# EAGLE design GBC USB-C Charging Kit Pro (EAGLE 6.2)
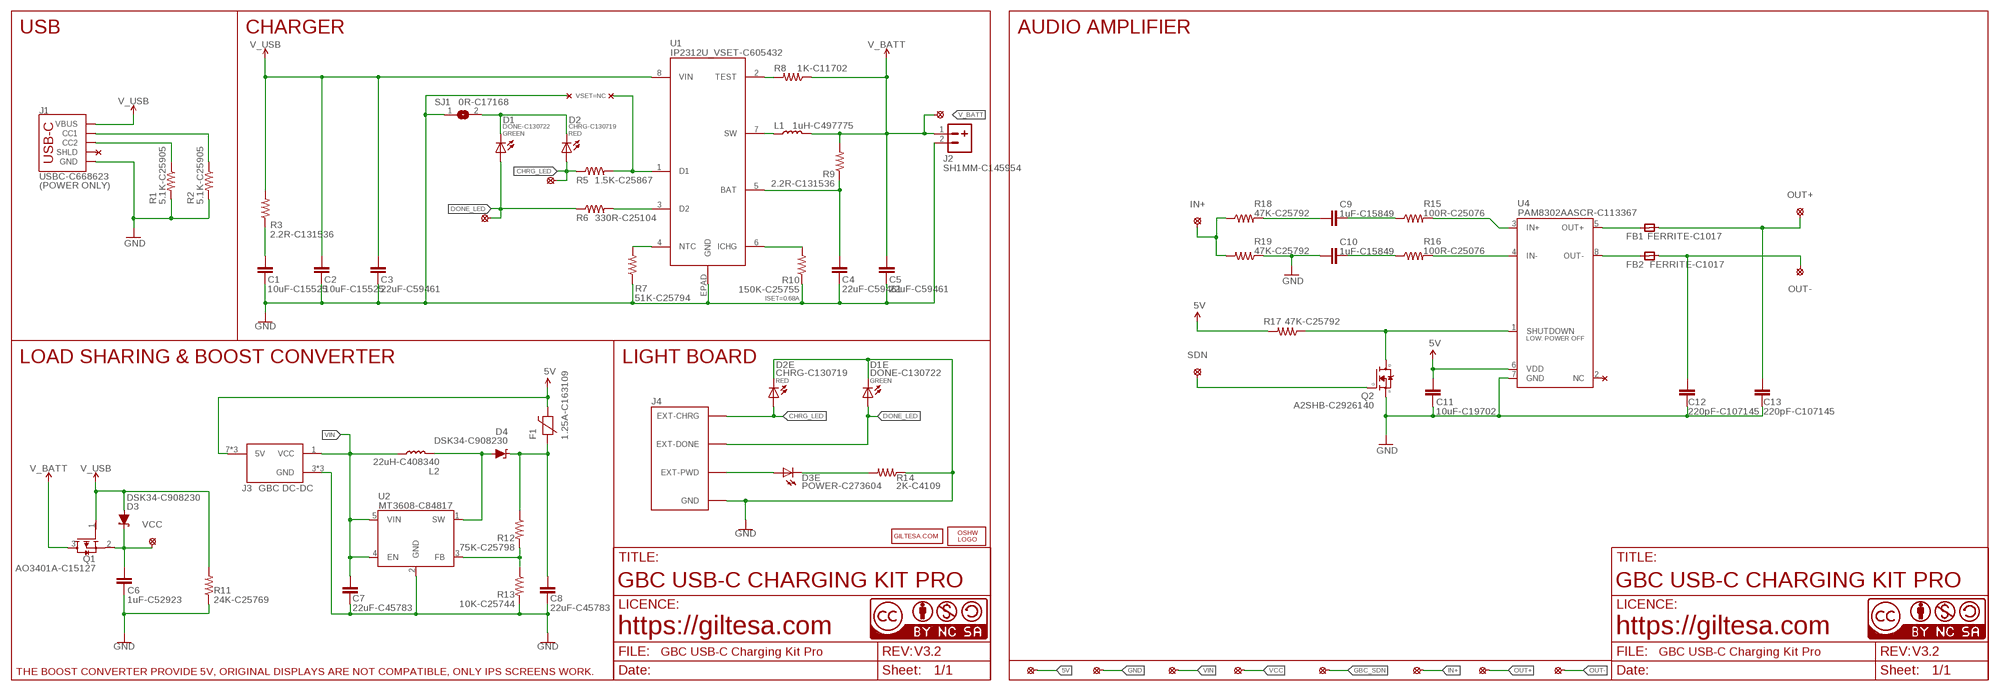
[diagram p0: schematic, sheet 1]

## Parts
C1  10uF-C15525  C0402_S  [C0402_S]
C2  10uF-C15525  C0402_S  [C0402_S]
C3  22uF-C59461  C0603_SMALL  [C0603_S]
C4  22uF-C59461  C0603_SMALL  [C0603_S]
C5  22uF-C59461  C0603_SMALL  [C0603_S]
C6  1uF-C52923  C0402_S  [C0402_S]
C7  22uF-C45783  C0805_SMALL  [C0805_S]
C8  22uF-C45783  C0805_SMALL  [C0805_S]
C9  1uF-C15849  C0603_SMALL  [C0603_S]
C10  1uF-C15849  C0603_SMALL  [C0603_S]
C11  10uF-C19702  C0603_SMALL  [C0603_S]
C12  220pF-C107145  C0805_SMALL  [C0805_S]
C13  220pF-C107145  C0805_SMALL  [C0805_S]
D1  DONE-C130722  LED_0402  [L0402]
D1E  DONE-C130722  LED_0402  [L0402]
D2  CHRG-C130719  LED_0402  [L0402]
D2E  CHRG-C130719  LED_0402  [L0402]
D3  DSK34-C908230  DIODE-SCHOTTKY_SOD-123FL  [SOD-123FL]
D3E  POWER-C273604  LED_0402  [L0402]
D4  DSK34-C908230  DIODE-SCHOTTKY_SOD-123FL  [SOD-123FL]
F1  1.25A-C163109  FUSE0603_S  [F0603_S]
FB1  FERRITE-C1017  MICROBUILDER_FERRITE_SMALL  [MICROBUILDER__0805MP_S]
FB2  FERRITE-C1017  MICROBUILDER_FERRITE_SMALL  [MICROBUILDER__0805MP_S]
J1  USBC-C668623  USB-C_6P_POWER  [USB-C_6P]
J2  SH1MM-C145954  JST-21MM  [JST-2-1MM-SMD_RIGHT]
J3  GBC DC-DC  GBC_DC_DCDIP_V2  [GBC_DC_DC_DIP_V2]
J4  GBC_LED_V2  [GBC_LED_V2]
L1  1uH-C497775  INDUCTOR_2  [PSPMAA0402]
L2  22uH-C408340  INDUCTOR_2  [PSPMAA0402]
LOGO2  OSHW_LOGO_FILLX0150-NT  [OSHW_FILLX150_NOTEXT]
PP1  SOLDER_PAD-1.5  [SOLDER_PAD_1.5]
PP2  SOLDER_PAD-1.5  [SOLDER_PAD_1.5]
PP3  SOLDER_PAD-1.5  [SOLDER_PAD_1.5]
PP4  SOLDER_PAD-1.5  [SOLDER_PAD_1.5]
PP5  SOLDER_PAD-1.5  [SOLDER_PAD_1.5]
PP6  SOLDER_PAD-1.5  [SOLDER_PAD_1.5]
PP7  SOLDER_PAD-1.5  [SOLDER_PAD_1.5]
PP8  SOLDER_PAD-1.5  [SOLDER_PAD_1.5]
Q1  AO3401A-C15127  AO3401A_SMALL  [SOT23-3_S]
Q2  A2SHB-C2926140  MOSFET-NCHANNEL_SMALL  [SOT23-3_S]
R1  5.1K-C25905  R0402  [R0402]
R2  5.1K-C25905  R0402  [R0402]
R3  2.2R-C131536  R0402  [R0402]
R5  1.5K-C25867  R0402  [R0402]
R6  330R-C25104  R0402  [R0402]
R7  51K-C25794  R0402  [R0402]
R8  1K-C11702  R0402  [R0402]
R9  2.2R-C131536  R0402  [R0402]
R10  150K-C25755  R0402  [R0402]
R11  24K-C25769  R0402  [R0402]
R12  75K-C25798  R0402  [R0402]
R13  10K-C25744  R0402  [R0402]
R14  2K-C4109  R0402  [R0402]
R15  100R-C25076  R0402  [R0402]
R16  100R-C25076  R0402  [R0402]
R17  47K-C25792  R0402  [R0402]
R18  47K-C25792  R0402  [R0402]
R19  47K-C25792  R0402  [R0402]
SJ1  0R-C17168  JUMPER-SMD0402  [JUMPER-SMD_0402]
U1  IP2312U_VSET-C605432  IP2312_CUSTOM  [IP2312]
U2  MT3608-C84817  MT3608"  [SOT-23-6]
U4  PAM8302AASCR-C113367  PAM8302A_ASCR  [PAM8302AASCR]
U$1  VCC  PAD_1.25  [PAD_1.25]
U$2  SDN  PAD_1.0  [PAD_1.0]
U$3  CHRG_LED  SOLDER_PAD-1.3  [SOLDER_PAD_1.3]
U$6  CC-BY-NC-SA15MM  [CC-BY-NC-SA_15MM]
U$16  GILTESA.COM_MASK  [GILTESA.COM_MASK_15MM]
U$17  CC-NC-BCNIX  [CC-NC-B_NIX]
U$20  OUT+  SOLDER_PAD-2.0  [SOLDER_PAD_2.0]
U$21  CC-NC-BCNIX  [CC-NC-B_NIX]
U$23  OUT-  SOLDER_PAD-2.0  [SOLDER_PAD_2.0]
U$24  CHRG_LED  SOLDER_PAD-1.3  [SOLDER_PAD_1.3]
U$25  DONE_LED  SOLDER_PAD-1.3  [SOLDER_PAD_1.3]
U$30  IN+  SOLDER_PAD-1.3  [SOLDER_PAD_1.3]

## Nets
5V: C11.1 F1.2 J3.7(5V) J3.7_1(5V) J3.7_2(5V) PP1.P$1 R17.2 U4.6(VDD)
CHRG_LED: D2.A D2E.A J4.EXT-CHRG R5.1 U$24.P$1
DONE_LED: D1.A D1E.A J4.EXT-DONE R6.1 U$25.P$1
GBC_SDN: PP5.P$1 Q2.1(G) U$2.P$1
GND: C1.1 C2.1 C3.1 C4.1 C5.1 C6.2 C7.1 C8.1 C10.2 C11.2 C12.2 C13.2 D1E.C D2E.C J1.A12-GND(GND) J1.B12-GND(GND) J2.2 J3.3(GND) J3.3_1(GND) J3.3_2(GND) J4.GND PP2.P$1 Q2.2(S) R1.2 R2.2 R7.1 R10.1 R11.1 R13.2 R14.1 R19.1 SJ1.1 U1.EPAD(GND) U2.2(GND) U4.7(GND)
IN+: PP6.P$1 R18.1 R19.2 U$30.P$1
N$1: D1.C D2.C SJ1.2
N$2: C8.2 D4.C F1.1 R12.1
N$3: D4.A L2.P$2 U2.1(SW)
N$4: J1.B5(CC2) R1.1
N$6: R8.2 U1.2(TEST)
N$7: R12.2 R13.1 U2.3(FB)
N$9: R16.2 U4.4(IN-)
N$10: D3E.A J4.EXT-PWD
N$11: D3E.C R14.2
N$12: R15.2 U4.3(IN+)
N$13: J1.A5(CC1) R2.1
N$14: C4.2 R9.1 U1.5(BAT)
N$15: C1.2 R3.1
N$16: C10.1 R16.1
N$17: FB2.1 U4.8(OUT-)
N$19: R5.2 U1.1(D1)
N$22: FB1.1 U4.5(OUT+)
N$23: C9.1 R15.1
N$25: C9.2 R18.2
N$27: R7.2 U1.4(NTC)
N$28: R10.2 U1.6(ICHG)
N$29: R6.2 U1.3(D2)
N$31: L1.P$1 U1.7(SW)
OUT+: C13.1 FB1.2 PP7.P$1 U$20.P$1
OUT-: C12.1 FB2.2 PP8.P$1 U$23.P$1
SDN: Q2.3(D) R17.1 U4.1(SHUTDOWN)
V_BATT: C5.2 J2.1 L1.P$2 Q1.3(D) R8.1 R9.2 U$3.P$1
V_USB: C2.2 C3.2 D3.A J1.A9-VBUS(VBUS) J1.B9-VBUS(VBUS) Q1.1(G) R3.2 R11.2 U1.8(VIN)
VCC: C6.1 D3.C PP4.P$1 Q1.2(S) U$1.P$1
VIN: C7.2 J3.1(VCC) L2.P$1 PP3.P$1 U2.4(EN) U2.5(VIN)
Unconnected: J1.SHLD1(SHLD) J1.SHLD2(SHLD) J1.SHLD3(SHLD) J1.SHLD4(SHLD) U4.2(NC)

## Notes on the sheet
- USB | CHARGER | AUDIO AMPLIFIER
- VSET=NC
- GREEN | RED
- (POWER ONLY)
- ISET=0.68A
- LOAD SHARING & BOOST CONVERTER | LIGHT BOARD
- RED | GREEN
- GBC USB-C CHARGING KIT PRO | GBC USB-C CHARGING KIT PRO
- https://giltesa.com | https://giltesa.com
- V3.2 | V3.2
- THE BOOST CONVERTER PROVIDE 5V, ORIGINAL DISPLAYS ARE NOT COMPATIBLE, ONLY IPS SCREENS WORK.

## Library data of the parts
C1 C2 C6 = ,giltesa:C0402
C3-C5 C9-C11 = ,giltesa:C0603
C7 C8 C12 C13 = ,giltesa:C0805
D1 D1E D2 D2E D3E = ,giltesa:LED
D3 D4 = ,giltesa:DIODE-SCHOTTKY
F1 = ,giltesa:FUSE
FB1 FB2 = microbuilder:MICROBUILDER_FERRITE: Ferrite Bead 0603 MMZ1608B121C - 120 Ohm @ 100MHz, 600mA, 0.15 Ohm DC Resistance - Digikey: 445-2164-1-ND BK1608HW121-T - 120 Ohm, 600mA Ferrite Chip - Digikey: 587-1876-2-ND 0805 HZ0805B272R-10 - 2.7K Ohm @ 100MHz, 200mA, 0.8 Ohm DC Resistance - Digikey: 240-2504-1-ND (see also Murata BLM21BD272SN1L) MMZ2012Y152B - 1.5K Ohm @ 100MHz, 500mA, 0.4 Ohm DC Resistance - Digikey: 445-1560-1-ND - Mainly for high frequency (80-400MHz) MMZ2012R102A - 1K Ohm @ 100MHz, 500mA, 0.3 Ohm DC Resistance - Digikey: 445-1555-2-ND - More general purpose (10-200MHz)
J1 = ,giltesa:USB-C_6P
J2 = ,giltesa:JST-2
J3 = ,giltesa:GBC_DC_DC
J4 = ,giltesa:GBC_LED_V2
L1 L2 = ,giltesa:INDUCTOR
LOGO2 = ohw-logo:OSHW_LOGO_FILL
PP1-PP8 U$3 U$20 U$23-U$25 U$30 = ,giltesa:SOLDER_PAD
Q1 = ,giltesa:AO3401A
Q2 = ,giltesa:MOSFET-NCHANNEL
R1-R3 R5-R19 = ,giltesa:R0402
SJ1 = ,giltesa:JUMPER-SMD
U1 = ,giltesa:IP2312
U2 = ,giltesa:MT3608
U4 = ,giltesa:PAM8302A
U$1 U$2 = ,giltesa:PAD
U$6 = ,giltesa_logos:CC-BY-NC-SA
U$16 = ,giltesa_logos:GILTESA.COM
U$17 U$21 = cc-by-nc-sa:CC-NC-BC: All hardware is licensed under the Creative Commons Attribution-Noncommercial-Share Alike 2.5 Switzerland License. To view a copy of this license, visit http://creativecommons.org/licenses/by-nc-sa/2.5/ch/ or send a letter to Creative Commons, 171 Second Street, Suite 300, San Francisco, California, 94105, USA.

## Net classes
1 power: width 0.61 mm, drill 0.406 mm, clearance 0.203 mm
2 gnd: width 0.305 mm, drill 0.406 mm, clearance 0.203 mm
3 power usb: width 0.508 mm, drill 0.406 mm, clearance 0.203 mm

## Board
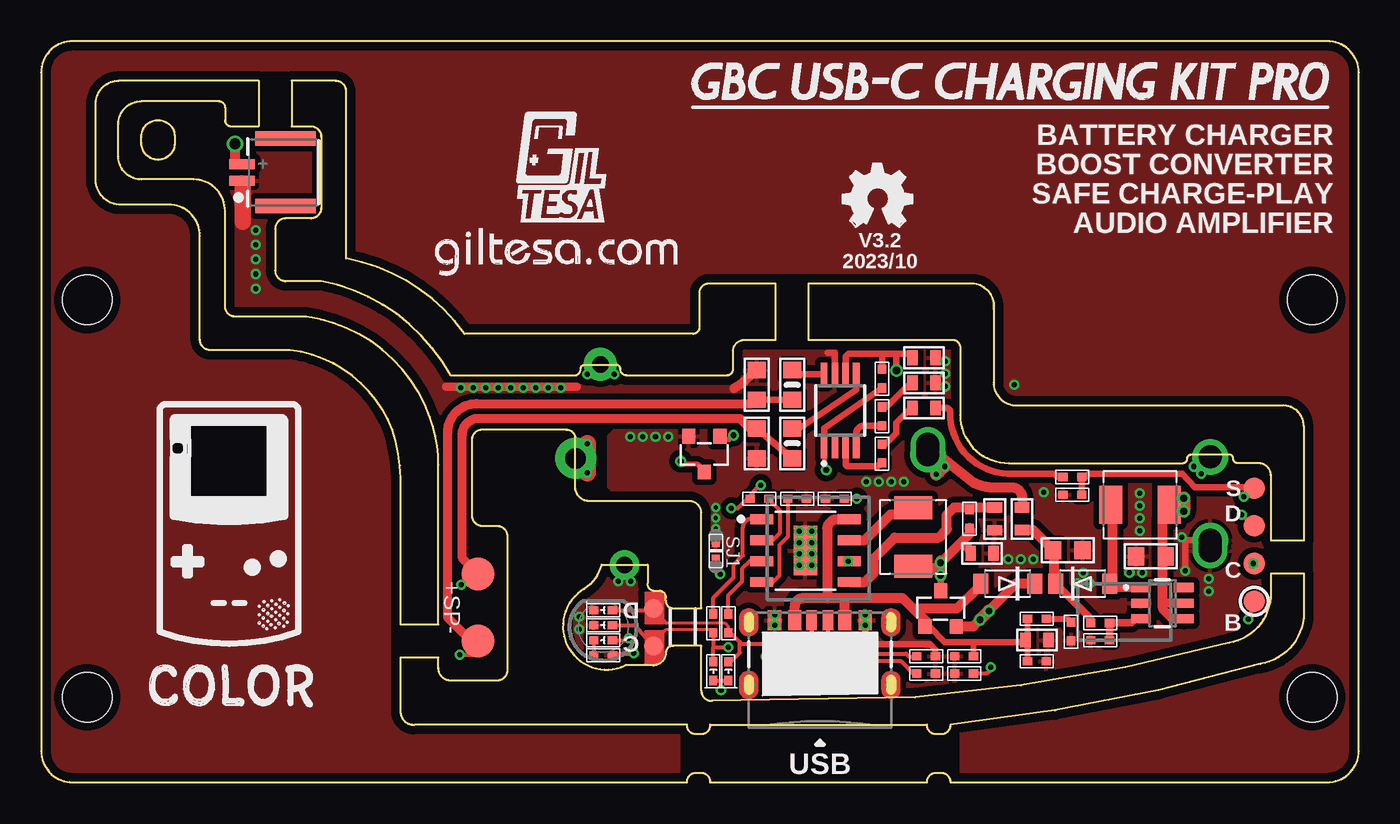
[diagram p1: board, top side]
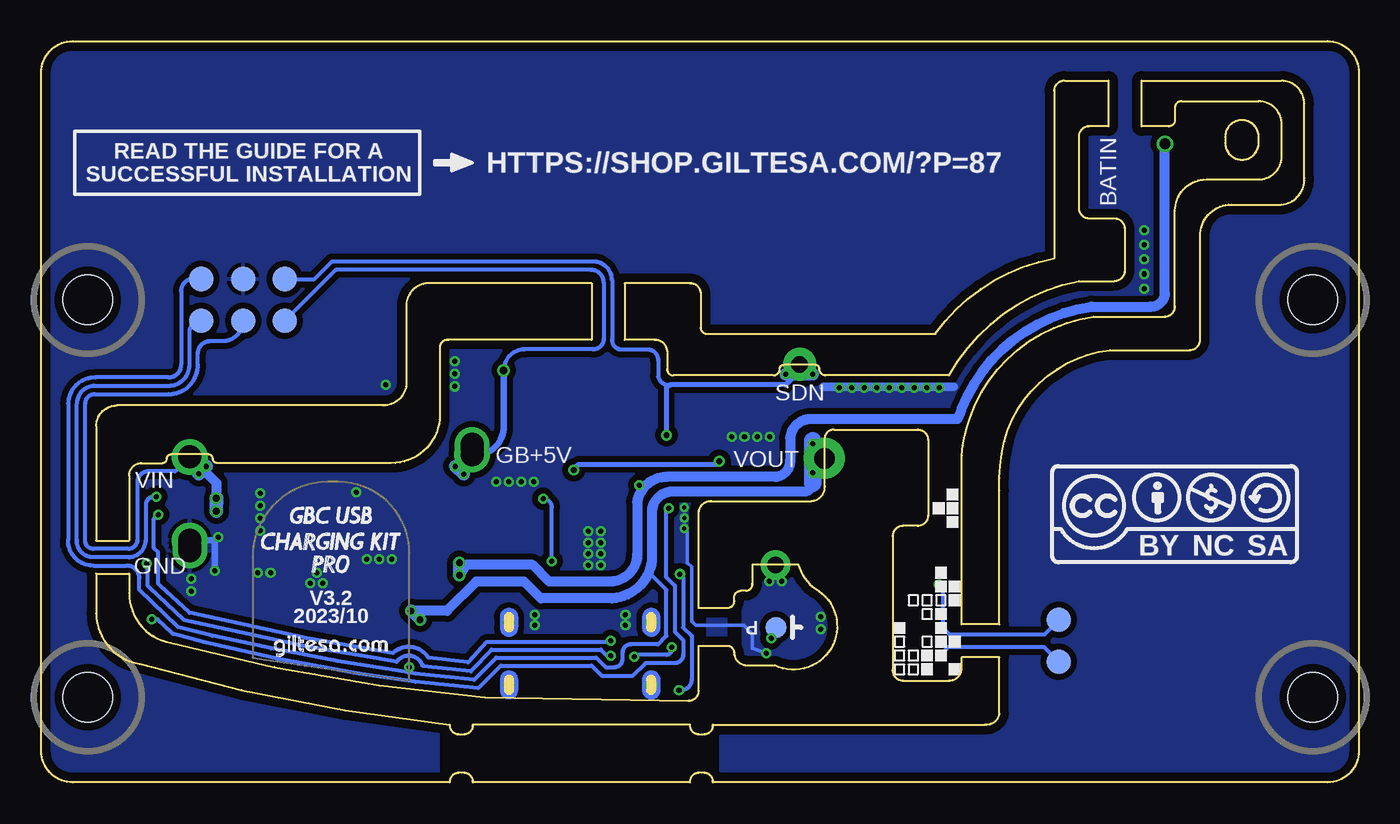
[diagram p2: board, bottom side, seen from below]

Size 80 x 45 mm. Coordinates in mm from the lower left corner, seen from the top.
Outline: 40.08,5.58 40.08,8.29 38.38,8.29 arc90 37.93,7.91 arc-90 37.13,7.1 35.46,7.1 arc-170 32.78,11.62 arc45 34.02,13.22 36.82,13.22 36.82,12.08 arc90 37.2,11.62 37.55,11.62 arc-90 37.93,11.19 37.93,11.03 arc90 38.3,10.58 40.08,10.58 40.08,16.38 arc90 39.31,17.07 33.23,17.07 arc-90 32.42,18 32.42,20.91 arc90 31.86,21.42 26.78,21.42 arc90 26.15,20.78 26.15,16.21 arc90 26.78,15.57 27.67,15.57 arc-90 28.31,14.94 28.31,6.81 arc-90 27.67,6.18 24.88,6.18 arc-90 24.11,6.94 24.11,7.59 21.83,7.59 21.83,4.2 arc90 22.69,3.5 39.21,3.5 arc90 39.72,2.92 40.1,2.92 arc90 40.61,3.5 53.79,3.5 arc90 54.29,2.92 54.67,2.92 arc90 55.2,3.5 arc10 74.03,7.19 arc80 76.66,10.24 76.66,12.67 74.66,12.67 74.66,11.51 arc-80 72.12,8.46 arc-10 53.06,5.16 40.72,4.94 arc-90 40.08,5.58
Outline: 24.88,24.7 32.37,24.7 arc90 32.75,25.1 arc-90 33.01,25.35 34.91,25.35 arc-90 35.16,25.1 arc90 35.55,24.7 41.62,24.7 arc90 42,25.08 42,26.19 arc-90 42.76,26.86 44.58,26.86 44.58,30.29 40.6,30.29 arc90 39.97,29.75 39.97,27.62 arc-90 39.58,27.23 25.71,27.23 arc44 18.5,31.81 18.5,41.98 arc90 17.87,42.6 15.21,42.6 15.21,39.83 16.37,39.83 arc-90 17,39.2 17,34.88 arc-90 16.37,34.24 14.84,34.24 arc90 14.21,33.61 14.21,31.07 arc90 14.84,30.43 17,30.43 arc-50 24.88,24.7
Outline: 46.58,26.86 55.28,26.86 arc-90 55.79,26.48 55.79,22.3 arc90 58.76,19.38 69.33,19.38 arc90 69.58,19.65 arc-90 69.83,19.91 72.12,19.91 arc-90 72.38,19.65 arc90 72.63,19.38 73.9,19.38 arc-90 74.66,18.62 74.66,14.67 76.66,14.67 76.66,21.62 arc90 75.4,22.88 59.24,22.88 arc-90 57.82,24.28 57.82,28.73 arc90 56.65,30.29 46.58,30.29 46.58,26.86
Outline: 1.91,0 39.21,0 arc-90 39.72,0.58 40.1,0.58 arc-90 40.61,0 53.79,0 arc-90 54.29,0.58 54.67,0.58 arc-90 55.2,0 78.07,0 arc90 80,1.91 80,43.1 arc90 78.07,45 1.91,45 arc90 0,43.1 0,1.91 arc90 1.91,0
Outline: 23.61,22.18 arc62 16.11,28.27 11.8,28.27 arc-90 11.16,28.91 11.16,34.7 arc90 9.26,36.6 6.08,36.6 arc-90 4.68,38 4.68,39.96 arc-90 6.08,41.35 10.78,41.35 arc-90 11.16,40.97 11.16,40.21 arc90 11.54,39.83 13.21,39.83 13.21,42.6 4.71,42.6 arc90 3.31,41.2 3.31,36.68 arc90 4.71,35.08 7.73,35.08 arc-90 9.64,33.18 9.64,26.88 arc90 10.27,26.24 15.1,26.24 arc-62 21.32,21.42 arc-20 21.83,17.73 21.83,9.59 24.11,9.59 24.11,19.26 arc20 23.61,22.18
Outline: 6.08,39.2 arc-180 8.11,39.2 8.11,38.81 arc-180 6.08,38.81 6.08,39.2
Copper layers (1*16): Top 0.035mm / dielectric 1.6mm / Bottom 0.035mm
Design rules: minimum track width 6mil, minimum drill 12mil, track to track 6mil, track to pad 6mil, pad to pad 6mil, via to via 8mil, smd to smd 0mil, copper to edge 20mil, drill to drill 10mil, minimum pad ring 6mil, minimum via ring 6mil, stop-mask expansion 0mil, vias tented up to drill 100mil, thermal gap 10mil
Holes 3 mm at 77.17,29.29 2.8,29.29 2.8,5.16 77.17,5.16
tRestrict: 18 lines
bRestrict: 14 lines

### Footprints (pad centres in the part's own frame; a part is rotated, then mirrored left to right if it is on the bottom)
C0402_S = smd 0.559 x 0.5: 1 -0.567,0; 2 0.567,0
C0603_S = smd 0.635 x 0.9: 1 -0.694,0; 2 0.694,0
C0805_S = smd 1 x 1.1: 1 -0.901,0; 2 0.901,0
L0402 = smd 0.559 x 0.5: A 0.567,0; C -0.567,0
SOD-123FL = smd 0.91 x 1.22: A 1.637,0; C -1.637,0
F0603_S = smd 0.635 x 0.9: 1 -0.694,0; 2 0.694,0
MICROBUILDER__0805MP_S = smd 1 x 1.1: 1 -0.901,0; 2 0.901,0
USB-C_6P = smd 0.635 x 1.2: A5 -0.5,2.034; B5 0.5,2.034 | smd 0.8 x 1.2: A9-VBUS 1.52,2.034; A12-GND 2.75,2.034; B9-VBUS -1.52,2.034; B12-GND -2.75,2.034 | drill 0.4 pad 0.6: SHLD1 -4.318,1.9; SHLD2 4.32,1.9; SHLD3 -4.318,-1.9; SHLD4 4.32,-1.9
JST-2-1MM-SMD_RIGHT = smd 0.6 x 1.524: 1 -0.5,-2.017; 2 0.5,-2.017 | smd 0.889 x 3.683: NC1 -2.054,0.635; NC2 2.054,0.635
GBC_DC_DC_DIP_V2 = drill 1.397 pad 2.159: 1 17.145,7.493; 3 17.145,2.413; 7 0,7.62 | drill 1.397 pad 2.032: 3_1 17.145,2.095; 3_2 17.145,1.778; 7_1 0,7.938; 7_2 0,8.255
GBC_LED_V2 = smd 1.143 x 1.143: EXT-CHRG -3.048,1.143; EXT-DONE -3.048,-1.143 | smd 1.27 x 1.27 bottom: EXT-PWD -1.27,0 | drill 1 pad 1.8: GND -1.293,-3.778
PSPMAA0402 = smd 1.4 x 2.3: P$1 -1.775,0; P$2 1.775,0
SOLDER_PAD_1.5 = smd 1.5 x 1.5: P$1 0,0
SOT23-3_S = smd 0.8 x 0.9: 1 -0.95,-1.076; 2 0.95,-1.076; 3 0,1.1
R0402 = smd 0.559 x 0.5: 1 -0.567,0; 2 0.567,0
JUMPER-SMD_0402 = smd 0.635 x 0.5: 1 -0.559,0; 2 0.559,0
IP2312 = smd 1.4 x 0.6: 1 -2.65,1.905; 2 -2.65,0.635; 3 -2.65,-0.635; 4 -2.65,-1.905; 5 2.65,-1.905; 6 2.65,-0.635; 7 2.65,0.635; 8 2.65,1.905 | smd 1.4 x 3: EPAD 0,0
SOT-23-6 = smd 0.55 x 1.2: 1 -0.95,-1.3; 2 0,-1.3; 3 0.95,-1.3; 4 0.95,1.3; 5 0,1.3; 6 -0.95,1.3
PAM8302AASCR = smd 0.4 x 1.4: 1 -0.975,-2.2; 2 -0.325,-2.2; 3 0.325,-2.2; 4 0.975,-2.2; 5 0.975,2.2; 6 0.325,2.2; 7 -0.325,2.2; 8 -0.975,2.2
PAD_1.25 = drill 1.25 pad 2.5: P$1 0,0
PAD_1.0 = drill 1 pad 2: P$1 0,0
SOLDER_PAD_1.3 = smd 1.3 x 1.3: P$1 0,0
SOLDER_PAD_2.0 = smd 2 x 2: P$1 0,0

### Placement (x,y rotation side)
C1  62.53,9.16 90 top
C2  60.45,7.35 180 top
C3  60.45,8.64 180 top
C4  57.9,16 90 top
C5  57.13,13.9 180 top
C6  56.04,6.61 180 top
C7  67.38,13.72 0 top
C8  62.34,14.1 180 top
C9  53.59,22.73 0 top
C10  53.59,24.26 0 top
C11  53.59,25.78 0 top
C12  43.43,24.13 90 top
C13  43.43,20.57 270 top
D1  41.72,6.75 90 top
D1E  34.12,10.46 0 top
D2  40.81,6.75 90 top
D2E  34.12,9.54 0 top
D3  58.67,12.06 180 top
D3E  34.12,8.63 0 top
D4  63.23,12.06 0 top
F1  59.55,16 90 top
FB1  45.59,20.57 270 top
FB2  45.59,24.13 270 top
J1  47.28,7.82 0 top
J2  14.21,37.04 270 top
J3  53.83,12.27 0 top
J4  34.12,9.41 180 top
L1  52.94,14.9 270 top
L2  66.71,16.85 180 top
LOGO2  48.65,33.75 0 top
PP1  65.2,28.02 0 bottom
PP2  67.75,30.56 0 bottom
PP3  67.75,28.02 0 bottom
PP4  70.28,30.56 0 bottom
PP5  65.2,30.56 0 bottom
PP6  70.28,28.02 0 bottom
PP7  18.21,9.86 0 bottom
PP8  18.21,7.32 0 bottom
Q1  54.61,10.54 0 top
Q2  40.26,19.94 180 top
R1  53.73,7.65 0 top
R2  53.73,6.61 0 top
R3  60.45,9.93 180 top
R5  40.81,9.65 90 top
R6  41.72,9.65 90 top
R7  45.9,17.22 180 top
R8  43.61,17.22 0 top
R9  56.37,16 270 top
R10  48.18,17.22 0 top
R11  56.04,7.65 0 top
R12  64.3,9.68 0 top
R13  64.3,8.63 180 top
R14  34.12,7.71 180 top
R15  51.05,19.96 270 top
R16  51.05,22.23 270 top
R17  51.05,24.51 90 top
R18  62.61,18.54 180 top
R19  62.61,17.46 0 top
SJ1  40.96,14.05 270 top
U1  46.4,14.07 0 top
U2  68.07,10.88 270 top
U4  48.51,22.59 0 top
U$1  32.45,19.67 0 top
U$2  33.94,25.38 0 top
U$3  73.64,11 0 top
U$6  18.74,13.24 0 bottom
U$7  [GBC_FRAME_LOGO]  6.52,4.55 0 top
U$9  [GILTESA_LOGO_MASK_7MM]  28.21,33.91 0 top
U$10  [TETRIS]  24.05,6.43 0 top
U$12  [GBC_PRO_FRAME]  39.55,41.4 0 top
U$16  23.8,30.69 0 top
U$17  0,0 0 top
U$20  26.53,12.65 0 top
U$21  0,0 0 top
U$23  26.53,8.59 0 top
U$24  73.64,13.29 0 top
U$25  73.64,15.57 0 top
U$30  73.64,17.86 0 top
U$33  [GILTESA.COM_MASK_7MM@1]  65.9,7.57 0 bottom
U$34  [GAME_BOY_COLOR_USB_CHARGING_KIT_PRO]  66.66,12.65 0 bottom

### Tracks (layer width: path | path; a pad name or v marks a point on that pad's centre or on a via)
5V  (via drill 0.3, 0.46)
  Top 0.406: U4.6 48.84,25.73 arc-90 49.15,26.04 51.18,26.04 | 51.18,26.04 51.92,26.04 | 51.92,26.04 52.65,26.04 arc-90 C11.1 | 51.18,26.04 51.05,25.91 R17.2 | v51.92,25.02 51.92,26.04 | v54.86,19.18 54.86,19.23 55.06,19.43
  Top 0.61: J3.7 54.48,19.89 55.06,19.43 56.58,18.22 arc30 57.91,17.91 58.93,17.91 arc-90 59.56,17.27 59.56,16.71 arc-90 F1.2
  Top 0.762: v54.33,18.69 54.51,18.82 v54.86,19.18
  Bottom 0.254: 65.01,28.08 65.01,28.02 PP1.P$1 62.11,31.11 46.61,31.11 arc90 45.85,30.35 45.85,26.92 arc90 46.48,26.29 50.65,26.29 arc-90 v51.92,25.02
  Bottom 0.406: v51.92,25.02 51.92,21.59 arc90 53.62,19.89 J3.7 J3.7_1 J3.7_2
  Bottom 0.762: v54.33,18.69 v54.86,19.18
CHRG_LED  (via drill 0.3)
  Top 0.178: R5.1 40.81,9.28 37.93,9.28 J4.EXT-CHRG
  Top 0.254: D2E.A 36.03,9.54 J4.EXT-CHRG | D2.A 40.81,8.19 | R5.1 40.81,8.19 | 40.81,8.19 v41.72,8.19 | v45.41,7.7 44.07,7.7 v43.99,7.62 | v73.58,13.29 73.53,13.27 U$24.P$1
  Bottom 0.254: v41.72,8.19 41.72,8.06 arc90 42.04,7.75 43.87,7.75 v43.99,7.62 | v73.58,13.29 73.53,13.24 73.53,11.94 73.41,11.81 71.31,9.84 64.14,8.28 58.42,7.32 arc125 56.82,7.06 53.91,6.74 52.65,8.05 46.02,8.05 45.67,7.7 v45.41,7.7
DONE_LED  (via drill 0.3)
  Top 0.178: R6.1 41.72,9.46 41.53,9.65 37.95,9.65 J4.EXT-DONE
  Top 0.254: D1E.A 37.15,10.46 J4.EXT-DONE | 41.72,9.08 R6.1 41.84,9.09 42.42,8.51 42.42,8.32 | D1.A 41.86,7.32 42.42,7.87 42.42,8.32 | v45.41,8.6 45.3,8.6 45.09,8.38 42.48,8.38 42.42,8.32 | 73.66,15.56 U$25.P$1 73.58,15.57 v72.9,16.26
  Bottom 0.254: v72.9,16.26 73.15,16 73.15,14.22 72.9,13.97 72.9,12.06 72.77,11.94 70.99,10.29 63.88,8.76 58.65,7.85 arc100 56.49,7.57 54.08,7.29 52.93,8.53 45.48,8.53 v45.41,8.6
GBC_SDN  (via drill 0.3, 0.36)
  Top 0.305: Q2.1 41.23,20.83 41.78,20.83 v42.04,21.08
  Bottom 0.254: PP5.P$1 63.42,30.56 62.36,31.62 46.48,31.62 arc90 45.34,30.48 45.34,26.92 arc-90 44.83,26.29 43.18,26.29 arc90 42.55,25.65 42.55,24.64 arc-60 42.04,24.13 42.04,23.88 | v34.8,24.77 34.16,24.77 34.1,24.83
  Bottom 0.305: U$2.P$1 33.95,24.98 34.1,24.83 34.8,24.13 41.78,24.13 arc-90 42.04,23.88 v42.04,21.08
  Bottom 0.762: v33.15,24.77 v34.8,24.77
GND  (via drill 0.25, 0.3)
  Top 0.203: SJ1.1 v40.96,15.42
  Top 0.254: R14.1 34.74,7.76 34.79,7.76 34.85,7.82 35.96,7.82 v35.97,7.84 | v35.02,12.21 J4.GND
  Top 0.406: U4.7 48.19,26.08 48.01,26.08 47.75,26.08 | v50.04,9.53 50.04,8.77 50.42,8.38 53.98,8.38 54.3,8.06 R1.2 | J3.3 69.47,14.69 69.47,12.83
  Top 0.508: 24.59,24.03 32.51,24.03
  Top 0.559: 43.32,25.03 arc-30 42.06,23.93
  Top 0.711: C12.2 43.32,25.03
  Top 1.016: 12.25,34.04 12.25,36.22
  Bottom 0.203: 35.92,7.89 v35.97,7.84 36.47,8.02 36.83,8.13 36.83,9.02 37.34,9.53 40.26,9.53 40.51,9.78 40.51,13.08 40.77,13.34 40.77,15.22 v40.96,15.42
  Bottom 0.254: v35.79,12.21 J4.GND
  Bottom 0.406: 69.47,12.83 69.47,14.69 J3.3
  Bottom 0.508: 24.59,24.03 32.51,24.03
  other vias: 25.46,23.96 26.22,23.96 26.99,23.96 27.75,23.96 28.51,23.96 29.27,23.96 30.03,23.96 30.8,23.96 31.56,23.96 13.02,33.53 13.02,32.64 13.02,31.75 13.02,30.86 13.02,29.98 54.9,25.56 54.9,24.8 54.9,24.04 59.09,24.15 35.77,20.99 36.54,20.99 66.71,17.56 66.71,16.8 66.71,16.03 66.71,15.27 66.08,12.73 66.84,12.73 37.3,20.99 38.06,20.99 32.67,10.05 32.67,9.29 46.02,15.25 46.78,15.25 46.02,14.56 46.78,14.56 46.78,13.88 46.02,13.88 46.02,13.19 46.78,13.19 50.04,10.16 44.52,10.16 44.52,9.53 63.66,12.1 62.9,12.1 63.28,12.73 60.24,13.54 40.96,16.05 40.96,16.69 69.47,12.86 69.25,14.89 70.9,12.35 70.9,11.59 59.48,13.54 58.72,13.54 60.88,17.61 52.37,18.24 51.61,18.24 50.84,18.24 50.08,18.24
  pour Top (isolate 0.356): -2,47 81.97,47 81.97,-2 -2,-2
  pour Bottom (isolate 0.356): -2,47 81.97,47 81.97,-2 -2,-2
IN+  (via drill 0.3)
  Top 0.254: v73.01,17.35 73.52,17.86 U$30.P$1
  Top 0.406: U$30.P$1 73.6,17.91 70.04,17.91 69.28,18.75 63.63,18.75 63.42,18.54 R18.1 R19.2
  Bottom 0.254: v73.01,17.35 73.14,17.35 arc-90 73.64,16.84 73.64,14.74 arc90 74.71,13.67 76.85,13.67 arc94 77.84,14.74 77.84,22.99 arc90 76.75,24.07 72.26,24.07 arc-90 70.99,25.34 70.99,27.31 arc90 PP6.P$1
  Bottom 0.406: 72.96,17.4 v73.01,17.35
N$1  (via drill 0.3)
  Top 0.254: v41.27,5.59 41.27,6.18 | SJ1.2 40.96,12.9 v41.22,12.65 | D2.C 41.27,6.18 | 41.27,6.18 D1.C
  Bottom 0.254: v41.22,12.65 v41.22,12.64 41.02,12.45 41.02,9.4 40.51,8.89 40.51,6.22 arc90 41.15,5.59 v41.27,5.59
N$2
  Top 0.457: R12.1 63.73,9.93 62.36,11.3 62.35,11.3 D4.C
  Top 0.61: D4.C 61.48,12.17 61.48,14.1 C8.2 60.23,15.31 F1.1
N$3
  Top 0.61: D4.A 64.74,11.78 64.9,11.94 | L2.P$2 64.9,16.81 64.97,16.81 65.02,16.76 65.02,11.85 D4.A | U2.1 64.88,11.83 D4.A
N$4
  Top 0.254: R1.1 53.13,7.62 52.7,7.62 52.51,7.81 49.15,7.81 arc-90 47.78,8.93 J1.B5
N$6
  Top 0.254: U1.2 43.78,14.73 44.45,14.73 44.83,15.11 44.83,16.51 44.18,17.16 R8.2
N$7
  Top 0.457: R13.1 R12.2 66.19,9.68 66.45,9.93 U2.3
N$9
  Top 0.406: R16.2 49.98,21.66 arc90 49.49,21.17 U4.4
N$10  (via drill 0.3)
  Top 0.254: D3E.A 35.56,8.63 v35.69,8.76
  Bottom 0.254: J4.EXT-PWD 35.39,8.92 v35.69,8.76
N$11
  Top 0.254: D3E.C R14.2
N$12
  Top 0.406: R15.2 51.02,19.4 50.8,19.18 49.02,19.18 arc-90 48.84,19.36 U4.3
N$13
  Top 0.254: R2.1 52.95,6.61 52.22,7.34 48.77,7.34 arc-90 46.78,9.33 J1.A5
N$14
  Top 0.254: R9.1 56.26,16.57 56.26,16.69
  Top 0.61: U1.5 50.01,12.16 50.55,12.7 50.55,13.59 51.82,14.86 54.48,14.86 54.99,15.37 54.99,16.26 55.43,16.69 56.26,16.69 C4.2
N$15
  Top 0.356: R3.1 62.32,9.93 C1.2
N$16
  Top 0.406: R16.1 51.34,22.79 52.81,24.26 C10.1
N$17
  Top 0.406: U4.8 45.84,24.79 FB2.1
N$19
  Top 0.254: 44.32,16 43.78,16 | 43.78,16 U1.1 | R5.2 40.81,11.22 42.04,12.45 42.04,13.21 42.61,13.78 42.61,15.49 arc-90 43.12,16 43.78,16
N$22
  Top 0.406: U4.5 49.49,23.84 46.35,21.72 45.99,21.48 FB1.1
N$23
  Top 0.406: C9.1 52.78,22.61 52.68,22.61 51.92,21.84 51.92,21.21 51.24,20.53 R15.1
N$25
  Top 0.406: R18.2 61.72,18.54 61.52,18.75 58.67,18.75 arc-90 55.19,22.48 arc90 54.94,22.73 C9.2
N$27
  Top 0.254: U1.4 44.42,12.16 44.83,12.57 44.83,14.41 45.34,14.92 R7.2
N$28  (via drill 0.3)
  Top 0.254: R10.2 v49.53,17.22 | v48.99,13.43 U1.6
  Bottom 0.254: v48.99,13.43 48.99,16.68 arc-90 v49.53,17.22
N$29
  Top 0.254: R6.2 41.72,11.37 42.55,12.19 42.55,12.95 43.02,13.43 U1.3
N$31
  Top 0.61: U1.7 50.01,14.7 51.56,16.26 52.45,16.26 52.87,16.55 L1.P$1
OUT+  (via drill 0.3)
  Top 0.254: v25.51,11.99 26.18,12.65 U$20.P$1
  Top 0.406: FB1.2 C13.1
  Top 0.559: U$20.P$1 25.58,13.61 25.58,21.13 arc-90 26.54,22.1 42.42,22.1 43.05,21.46 C13.1
  Top 0.61: U$20.P$1 26.34,12.65
  Bottom 0.254: PP7.P$1 19.11,8.97 24.84,8.97 25.27,9.4 25.27,11.75 v25.51,11.99
OUT-  (via drill 0.3)
  Top 0.254: v25.4,7.75 26.54,7.75 26.54,8.58 U$23.P$1
  Top 0.406: FB2.2 C12.1
  Top 0.559: 26.08,8.59 24.69,9.98 24.69,21.26 arc-90 26.42,22.99 43.18,22.99 C12.1
  Top 0.61: U$23.P$1 26.08,8.59
  Bottom 0.254: PP8.P$1 19.1,8.21 24.94,8.21 v25.4,7.75
SDN  (via drill 0.36)
  Top 0.305: Q2.3 40.26,18.92 39.88,19.3 39.02,19.3 v38.83,19.5 | U4.1 47.54,19.09 v47.67,18.96
  Top 0.406: U4.1 47.54,21.5 50.04,23.24 R17.1 | Q2.3 40.26,18.8
  Bottom 0.305: v47.67,18.96 47.67,19.01 47.37,19.3 39.02,19.3 v38.83,19.5
V_BATT  (via drill 0.3, 0.41, 0.66)
  Top 0.254: v43.69,18.05 43.62,18.1 42.99,17.34 | 42.99,17.34 42.29,16.64 v41.91,16.64 | R8.1 43.04,17.28 42.99,17.34 | v73.28,9.91 arc18 U$3.P$1
  Top 0.406: v54.61,13.34 Q1.3 | 11.77,37.6 12.19,37.6 J2.1
  Top 0.61: 11.77,37.6 v11.77,38.76 | L1.P$2 54.61,13 v54.61,13.34 | v54.61,13.34 54.61,13.46 | R9.2 56.37,15.09 55.88,14.61 | 55.88,14.61 v54.61,13.34 | C5.2 56.44,14.05 55.88,14.61
  Top 0.762: v54.61,13.34 v54.61,12.57
  Bottom 0.254: v43.69,18.05 43.56,17.78 43.56,17.27 43.81,17.02 | v73.28,9.91 72.95,9.91 72.01,9.02 70.1,8.51 65.66,7.49 60.71,6.6 57.28,6.1 53.47,5.71 52.09,7.09 46.58,7.09 45.97,6.48 44.07,6.48 43.31,7.24 41.53,7.24 arc-90 41.02,7.75 41.02,8.64 41.53,9.14 41.53,11.94 42.04,12.45 42.04,16.51 v41.91,16.64
  Bottom 0.61: v11.77,38.76 11.77,29.67 arc90 12.69,28.88 16.24,28.88 arc-60 24.11,22.69 24.37,22.05 33.39,22.05 arc-80 34.53,20.91 34.53,19.57 arc90 35.43,18.54 42.04,18.54 arc-80 43.81,17.02 43.81,13.84 arc90 45.47,12.19 49.15,12.19 50.16,13.21 54.23,13.21 v54.61,12.57
  Bottom 0.762: v54.61,12.57 v54.61,13.34
V_USB
  Top 0.254: 54.74,10.41 54.86,10.54
  Top 0.356: R11.2 56.61,8.42 56.52,8.51 | R3.2 C2.2 59.88,8.51 C3.2
  Top 0.406: C3.2 59.69,8.64 59.56,8.51 56.52,8.51 54.86,8.51 53.91,9.46 Q1.1
  Top 0.584: U1.8 48.33,15.97
  Top 0.61: 48.9,11.18 52.32,11.18 52.96,10.54 | 48.9,11.18 47.73,11.18 | 47.73,11.18 46.23,11.18 arc90 45.76,10.71 J1.B9-VBUS | 47.73,11.18 47.73,15.37 arc-90 48.33,15.97 | 52.96,10.54 53.76,9.74 Q1.1 | 52.96,10.54 54.86,10.54 55.59,10.54 56.94,11.85 57.04,11.82 D3.A | J1.A9-VBUS 48.8,11.08 48.9,11.18
VCC  (via drill 0.3, 0.41)
  Top 0.254: v57.66,6.99 arc-90 57.28,6.6 C6.1 arc-90 C6.1
  Top 0.508: 57,9.96 v57,9.87
  Top 0.61: 57.58,10.46 v57.54,10.41 | D3.C 59.18,12.06 56.58,9.46 | Q1.2 56.58,9.46 | v57,9.87 56.59,9.46 56.58,9.46
  Top 0.762: v57.54,10.41 v57,9.87
  Top 1.067: v33.15,20.56 v33.15,18.78
  Bottom 0.203: U$1.P$1 32.5,19.67 32.51,19.68
  Bottom 0.254: PP4.P$1 70.79,30.56 arc-90 71.5,29.84 71.5,25.34 arc90 72.26,24.58 76.71,24.58 arc-90 78.36,22.99 78.36,14.74 arc-92 76.85,13.16 74.8,13.16 arc90 74.04,12.4 74.04,11.68 71.68,9.42 69.6,8.89 66.04,8.13 61.98,7.37 57.73,6.68 | 45.34,11.18 44.58,11.18 44.2,11.56 43.94,11.56 | 42.93,13.46 42.93,12.57 42.04,11.68 42.04,8.89 42.55,8.38 44.2,8.38 arc-90 44.7,7.87 44.7,7.49 arc90 45.21,6.99 45.72,6.99 46.3,7.57 52.38,7.57 53.72,6.22 57.28,6.6 57.73,6.68 | v57.66,6.99 57.73,6.68
  Bottom 0.61: 33.15,18.16 arc90 33.78,17.65 41.66,17.65 arc-90 42.93,16.38 42.93,13.46 arc80 45.34,11.18 49.66,11.18 50.67,12.19 53.59,12.19 55.37,10.41 v57.54,10.41 57.41,10.29 | 32.45,19.68 32.51,19.68 33.15,19.68 | v57,9.87 57,10.01 57.15,10.16 | 57.02,9.89 v57,9.87 | 56.97,9.91 v57,9.87
  Bottom 0.762: v57,9.87 v57.54,10.41
  Bottom 1.067: 33.15,20.75 v33.15,20.56 33.15,19.68 33.15,18.16
VIN  (via drill 0.3, 0.41)
  Top 0.406: 70.48,18.67 v69.98,19.18 70.39,19.18 J3.1
  Top 0.559: U2.4 68.68,9.93 68.07,10.54 68.07,10.67 68.07,10.92 68.11,10.88 U2.5
  Top 0.61: 68.07,13.21 68.07,16 68.48,16.41 L2.P$1 v69.37,17.26 | 68.07,13.21 68.07,10.67 | C7.2 68.2,13.72 68.07,13.21
  Top 0.813: v69.37,17.26 v69.37,16.46
  Bottom 0.254: 68.31,28.02 PP3.P$1 arc90 68.97,26.8 69.72,26.8 arc-90 70.48,26.04 70.48,25.34 arc90 72.26,23.57 76.75,23.57 arc-90 77.33,22.99 77.33,14.74 arc-99 76.85,14.18 74.71,14.18 arc-90 74.15,14.74 74.15,18.24 arc90 73.52,18.88 71.87,18.88 J3.1
  Bottom 0.356: 69.35,17.26 69.46,17.16 v69.37,17.25
  Bottom 0.61: J3.1 70.95,19.77 69.37,18.19 v69.37,17.25
  Bottom 0.813: v69.37,17.25 v69.37,16.46 69.35,17.26 | v70.42,18.73 v69.98,19.18

### Text on the board
tPlace: BATTERY CHARGER | BOOST CONVERTER | SAFE CHARGE-PLAY | AUDIO AMPLIFIER | V3.2 | 2023/10 | S | D | SJ1 | C | +SP- | B | USB
bPlace: HTTPS://SHOP.GILTESA.COM/?P=87 | READ THE GUIDE FOR A | SUCCESSFUL INSTALLATION | BATIN | SDN | VOUT | GB+5V | VIN | GND | V3.2 | 2023/10